# Altium schematic sheet mcu.SchDoc
size A3; SheetNumber: 1; SheetTotal: 3
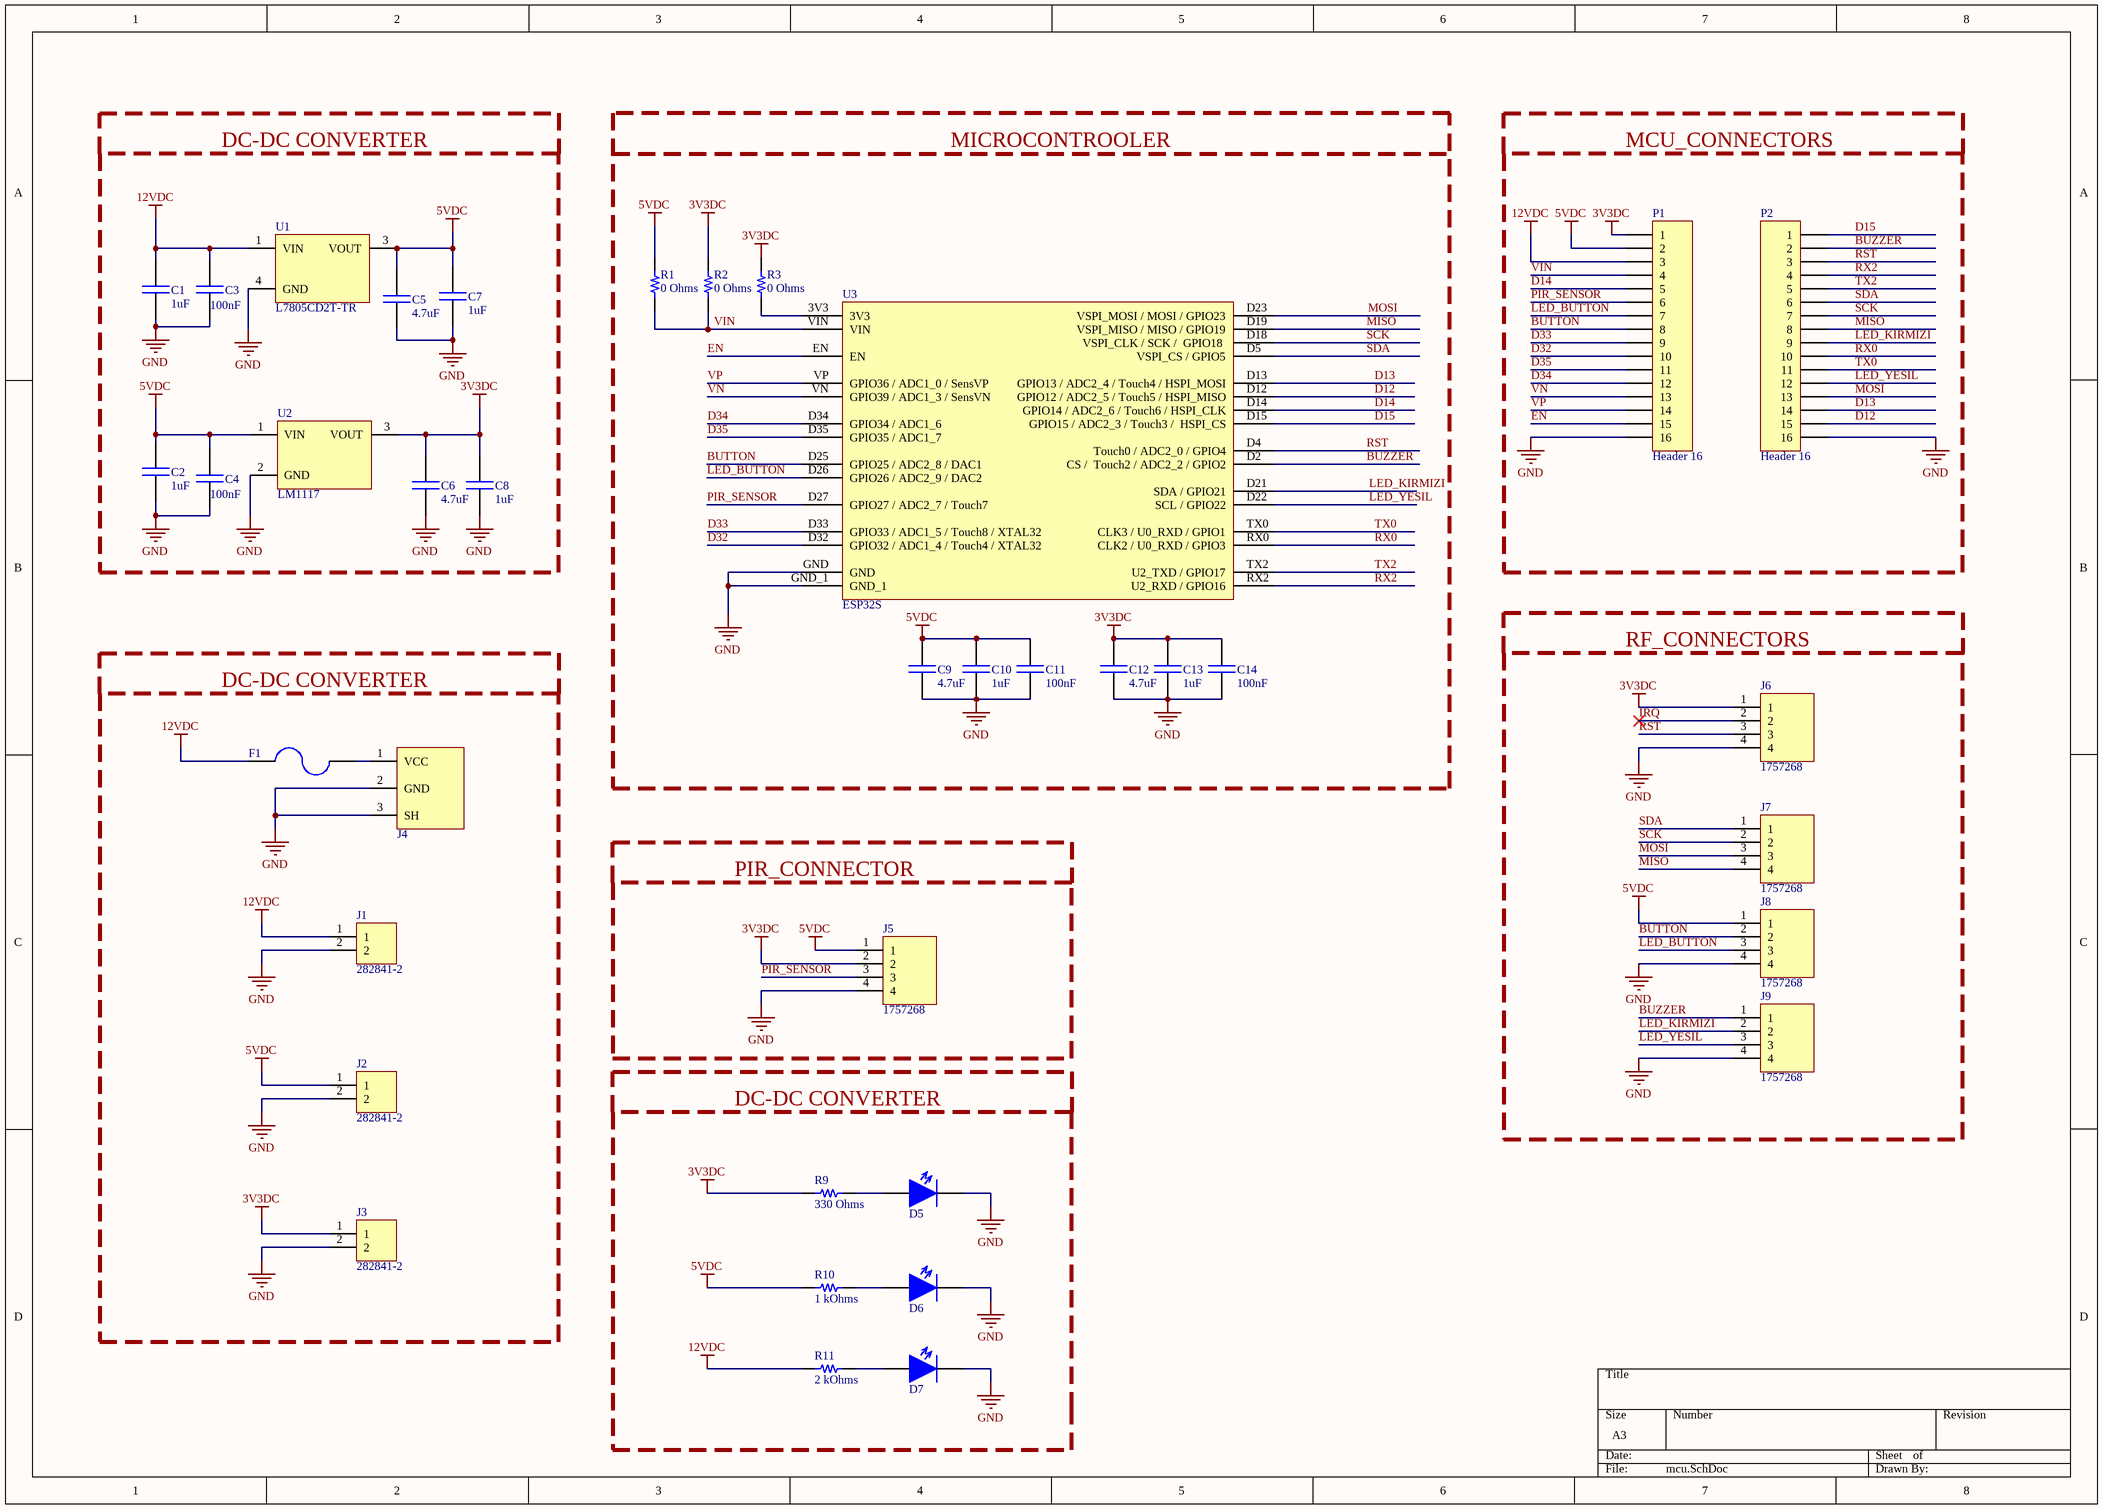
[diagram p0: mcu.SchDoc]

## Parts
C1  Capacitance: 1uF  [CAP_0805]  (hidden comment: CL21B105KBFNNNE)
C2  Capacitance: 1uF  [CAP_0805]  (hidden comment: CL21B105KBFNNNE)
C3  Capacitance: 100nF  [CAP_0805]  (hidden comment: CL21B104KBCNNNC)
C4  Capacitance: 100nF  [CAP_0805]  (hidden comment: CL21B104KBCNNNC)
C5  Capacitance: 4.7uF  [CAP_0805]  (hidden comment: CL21A475KAQNNNE)
C6  Capacitance: 4.7uF  [CAP_0805]  (hidden comment: CL21A475KAQNNNE)
C7  Capacitance: 1uF  [CAP_0805]  (hidden comment: CL21B105KBFNNNE)
C8  Capacitance: 1uF  [CAP_0805]  (hidden comment: CL21B105KBFNNNE)
C9  Capacitance: 4.7uF  [CAP_0805]  (hidden comment: CL21A475KAQNNNE)
C10  Capacitance: 1uF  [CAP_0805]  (hidden comment: CL21B105KBFNNNE)
C11  Capacitance: 100nF  [CAP_0805]  (hidden comment: CL21B104KBCNNNC)
C12  Capacitance: 4.7uF  [CAP_0805]  (hidden comment: CL21A475KAQNNNE)
C13  Capacitance: 1uF  [CAP_0805]  (hidden comment: CL21B105KBFNNNE)
C14  Capacitance: 100nF  [CAP_0805]  (hidden comment: CL21B104KBCNNNC)
D5  LTST-C171GKT  [LED_GREEN_0805]  (value not drawn)
D6  LH R974-LP-1-0-20-R18  [LED_RED_0805]  (value not drawn)
D7  LH R974-LP-1-0-20-R18  [LED_RED_0805]  (value not drawn)
F1  FUSE 3413.0216.22  [FUSE 3413.0216.22]  (value not drawn)
J1  282841-2  [connector_2pİN]
J2  282841-2  [connector_2pİN]
J3  282841-2  [connector_2pİN]
J4  PJ-037AH-SMT-TR  [JACK]  (value not drawn)
J5  1757268  [CONNECTOR_4Pin]
J6  1757268  [CONNECTOR_4Pin]
J7  1757268  [CONNECTOR_4Pin]
J8  1757268  [CONNECTOR_4Pin]
J9  1757268  [CONNECTOR_4Pin]
P1  Header 16  [HDR1X16]
P2  Header 16  [HDR1X16]
R1  0 Ohms  [RES 1206_3216]
R2  0 Ohms  [RES 1206_3216]
R3  0 Ohms  [RES 1206_3216]
R9  330 Ohms  [RES 0805_2012]
R10  1 kOhms  [RES 0805_2012]
R11  2 kOhms  [RES 0805_2012]
U1  L7805CD2T-TR  [D2PAK]
U2  LM1117  [SOT223]
U3  ESP32S  [ESP32_BOARD]

## Blocks framed on the sheet
MICROCONTROOLER: C9-C14 R1-R3 U3
DC-DC CONVERTER: C1-C8 U1 U2
MCU_CONNECTORS: P1 P2
RF_CONNECTORS: J6-J9
DC-DC CONVERTER: F1 J1-J4
PIR_CONNECTOR: J5
DC-DC CONVERTER: D5-D7 R9-R11

## Nets
3V3DC: C6.2 C8.2 C12.2 C13.2 C14.2 J3.1 J5.2 J6.1 P1.1 R2.2 R3.2 R9.1 U2.3(VOUT)
5VDC: C2.2 C4.2 C5.2 C7.2 C9.2 C10.2 C11.2 J2.1 J5.1 J8.1 P1.2 R1.2 R10.1 U1.3(VOUT) U2.1(VIN)
12VDC: C1.2 C3.2 F1.1 J1.1 P1.3 R11.1 U1.1(VIN)
GND: C1.1 C2.1 C3.1 C4.1 C5.1 C6.1 C7.1 C8.1 C9.1 C10.1 C11.1 C12.1 C13.1 C14.1 D5.1 D6.1 D7.1 J1.2 J2.2 J3.2 J4.2(GND) J4.3(SH) J5.4 J6.4 J8.4 J9.4 P1.16 P2.16 U1.4(GND) U2.2(GND) U3.GND U3.GND_1
BUTTON: J8.2 P1.8 U3.D25(GPIO25_/_ADC2_8_/_DAC1)
BUZZER: J9.1 P2.2 U3.D2(CS_/__Touch2_/_ADC2_2_/_GPIO2)
D12: P2.15 U3.D12(GPIO12_/_ADC2_5_/_Touch5_/_HSPI_MISO)
D13: P2.14 U3.D13(GPIO13_/_ADC2_4_/_Touch4_/_HSPI_MOSI)
D14: P1.5 U3.D14(GPIO14_/_ADC2_6_/_Touch6_/_HSPI_CLK)
D15: P2.1 U3.D15(GPIO15_/_ADC2_3_/_Touch3_/__HSPI_CS)
D32: P1.10 U3.D32(GPIO32_/_ADC1_4_/_Touch4_/_XTAL32)
D33: P1.9 U3.D33(GPIO33_/_ADC1_5_/_Touch8_/_XTAL32)
D34: P1.12 U3.D34(GPIO34_/_ADC1_6)
D35: P1.11 U3.D35(GPIO35_/_ADC1_7)
EN: P1.15 U3.EN
IRQ: J6.2
LED_BUTTON: J8.3 P1.7 U3.D26(GPIO26_/_ADC2_9_/_DAC2)
LED_KIRMIZI: J9.2 P2.9 U3.D21(SDA_/_GPIO21)
LED_YESIL: J9.3 P2.12 U3.D22(SCL_/_GPIO22)
MISO: J7.4 P2.8 U3.D19(VSPI_MISO_/_MISO_/_GPIO19)
MOSI: J7.3 P2.13 U3.D23(VSPI_MOSI_/_MOSI_/_GPIO23)
PIR_SENSOR: J5.3 P1.6 U3.D27(GPIO27_/_ADC2_7_/_Touch7)
RST: J6.3 P2.3 U3.D4(Touch0_/_ADC2_0_/_GPIO4)
RX0: P2.10 U3.RX0(CLK2_/_U0_RXD_/_GPIO3)
RX2: P2.4 U3.RX2(U2_RXD_/_GPIO16)
SCK: J7.2 P2.7 U3.D18(VSPI_CLK_/_SCK_/__GPIO18)
SDA: J7.1 P2.6 U3.D5(VSPI_CS_/_GPIO5)
TX0: P2.11 U3.TX0(CLK3_/_U0_RXD_/_GPIO1)
TX2: P2.5 U3.TX2(U2_TXD_/_GPIO17)
VIN: P1.4 R1.1 R2.1 U3.VIN
VN: P1.13 U3.VN(GPIO39_/_ADC1_3_/_SensVN)
VP: P1.14 U3.VP(GPIO36_/_ADC1_0_/_SensVP)
NetD5_2: D5.2 R9.2
NetD6_2: D6.2 R10.2
NetD7_2: D7.2 R11.2
NetF1_2: F1.2 J4.1(VCC)
NetR3_1: R3.1 U3.3V3

## Library data of the parts
C1 C2 C7 C8 C10 C13 = CAP CER 1uF 0805: CAP CER 1uF  %10 0805; Manufacturer: Samsung; Tolerance: 10%; Voltage Rating: 50V; Dielectric: X7R; Designed by: EMRE; Supplier 1: Digi-Key; Manufacturer Part Number: CL21B105KBFNNNE; RoHS: Yes; Category: Ceramic Capacitors; Stock 1: 279465; Pricing 1: 1=0,11000, 10=0,07900, 50=0,04500, 100=0,03730, 500=0,02616, 1000=0,02165 (USD); Mount: Surface Mount; Case/Package: 0805; Case Code (Metric): 2012; Case Code (Imperial): 0805; Min Operating Temperature: -55°C; Max Operating Temperature: 125°C; Packaging: Tape and Reel; Package Quantity: 1; Voltage: 50V; Series: CL; Construction: Flat; Length: 2mm; Width: 0.049inch; Height: 1.25mm; Thickness: 0.053inch; Depth: 1.25mm; Radiation Hardening: No; RoHS Compliant: Yes; ComponentLink1URL: https://datasheet.ciiva.com/25800/cl21b105kbfnnne-25800291.pdf?src-supplier=Digi-Key; ComponentLink1Description: https://datasheet.ciiva.com/25800/cl21b105kbfnnne-25800291.pdf?src-supplier=Digi-Key; ComponentLink2URL: https://datasheet.ciiva.com/16449/cl21b105kbfnnne-16449003.pdf?src-supplier=Future+Electronics; ComponentLink2Description: https://datasheet.ciiva.com/16449/cl21b105kbfnnne-16449003.pdf?src-supplier=Future+Electronics; ComponentLink3URL: https://datasheet.ciiva.com/26838/getdatasheetpartid-354075-26838668.pdf?src-supplier=Verical; ComponentLink3Description: https://datasheet.ciiva.com/26838/getdatasheetpartid-354075-26838668.pdf?src-supplier=Verical; Supplier Part Number 1: 1276-1029-1-ND
C3 C4 C11 C14 = CAP CER 100nF 0805: CAP CER 100nF  %10 0805; Manufacturer: Samsung; Designed by: EMRE; Material: Ceramic; Tolerance: 10%; Dielectric: X7R; Voltage Rating: 50V; Supplier 1: Digi-Key; Manufacturer Part Number: CL21B104KBCNNNC; RoHS: Yes; Category: Ceramic Capacitors; Stock 1: 4556397; Pricing 1: 1=0,10000, 10=0,04400, 50=0,02400, 100=0,01960, 500=0,01404, 1000=0,01103 (USD); Mount: Surface Mount; Case/Package: 0805; Case Code (Metric): 2012; Case Code (Imperial): 0805; Contact Plating: Tin; Min Operating Temperature: -55°C; Max Operating Temperature: 125°C; Packaging: Tape and Reel; Voltage: 50V; Voltage Rating (DC): 50V; Series: CL; Construction: Flat; Length: 2mm; Width: 0.049inch; Height: 0.85mm; Depth: 1.25mm; Thickness: 0.037inch; Radiation Hardening: No; Lead Free: Lead Free; RoHS Compliant: Yes; ComponentLink1URL: https://datasheet.ciiva.com/25710/cl21b104kbcnnnc-25710182.pdf?src-supplier=Digi-Key; ComponentLink1Description: https://datasheet.ciiva.com/25710/cl21b104kbcnnnc-25710182.pdf?src-supplier=Digi-Key; ComponentLink2URL: https://datasheet.ciiva.com/29199/454152-da-01-en-vs-kondensator-0805-29199814.pdf?src-supplier=Conrad; ComponentLink2Description: https://datasheet.ciiva.com/29199/454152-da-01-en-vs-kondensator-0805-29199814.pdf?src-supplier=Conrad; Supplier Part Number 1: 1276-1003-1-ND
C5 C6 C9 C12 = CAP CER 4.7uF 0805: CAP CER 4.7UF  %10 0805; Manufacturer: Samsung; Designed by: EMRE; Tolerance: 10%; Voltage Rating: 25V; Dielectric: X5R; Supplier 1: Digi-Key; Manufacturer Part Number: CL21A475KAQNNNE; RoHS: Yes; Category: Ceramic Capacitors; Stock 1: 4929728; Pricing 1: 1=0,10000, 10=0,07300, 50=0,04140, 100=0,03440, 500=0,02408, 1000=0,01994 (USD); Mount: Surface Mount; Case/Package: 0805; Case Code (Metric): 2012; Case Code (Imperial): 0805; Min Operating Temperature: -55°C; Max Operating Temperature: 85°C; Package Quantity: 1; Packaging: Tape and Reel; Voltage Rating (DC): 25V; Series: CL; Construction: Flat; Length: 2mm; Width: 0.049inch; Height: 1.25mm; Thickness: 0.055inch; Depth: 1.25mm; Radiation Hardening: No; Lead Free: Lead Free; RoHS Compliant: Yes; ComponentLink1URL: https://datasheet.ciiva.com/25798/cl21a475kaqnnne-25798882.pdf?src-supplier=Digi-Key; ComponentLink1Description: https://datasheet.ciiva.com/25798/cl21a475kaqnnne-25798882.pdf?src-supplier=Digi-Key; Supplier Part Number 1: 1276-1244-1-ND
D5 = LED GREEN 0805: Green 569nm LED Indication - Discrete 2.1V 0805 (2012 Metric); Manufacturer: Vishay Lite-On; Designed by: EMRE; Lens Color: Colorless; Viewing Angle: 130°; Lens Style: Diffused,Colorless,Rectangular,Clear; Luminous Intensity: 12mcd; Forward Current: 30mA; Power Rating: 100mW; Test Current: 10mA; Lens Transparency: Clear; Number of Elements: 1; Wavelength: 585nm; Reverse Voltage: 5V; Supplier 1: Digi-Key; Manufacturer Part Number: LTST-C171GKT; RoHS: Yes; Category: LEDs; Stock 1: 498344; Pricing 1: 1=0,26000, 10=0,14100, 100=0,06560, 500=0,06060, 1000=0,04747 (USD); Mount: Surface Mount; Case/Package: 0805; Number of Pins: 2; Color: Green; Case Code (Metric): 2012; Case Code (Imperial): 0805; Min Operating Temperature: -55°C; Max Operating Temperature: 85°C; Package Quantity: 1; Packaging: Tape and Reel; Forward Voltage: 2.1V; Illumination Color: Green; Dominant Wavelength: 569nm; Power Dissipation: 100mW; Number of LEDs: 1; Series: CHIPLED 0805; Length: 2mm; Width: 1.25mm; Height: 0.8mm; Depth: 1.25mm; Radiation Hardening: No; Lead Free: Lead Free; RoHS Compliant: Yes; ComponentLink1URL: https://datasheet.ciiva.com/2110/ltst-c171gkt-2110000.pdf?src-supplier=Digi-Key; ComponentLink1Description: https://datasheet.ciiva.com/2110/ltst-c171gkt-2110000.pdf?src-supplier=Digi-Key; ComponentLink2URL: https://datasheet.ciiva.com/11773/0900766b80dc0296-11773991.pdf?src-supplier=RSComponents; ComponentLink2Description: https://datasheet.ciiva.com/11773/0900766b80dc0296-11773991.pdf?src-supplier=RSComponents; ComponentLink3URL: https://datasheet.ciiva.com/12400/lite-on-ltst-c171gkt-190133-12400647.pdf?src-supplier=Mouser; ComponentLink3Description: https://datasheet.ciiva.com/12400/lite-on-ltst-c171gkt-190133-12400647.pdf?src-supplier=Mouser; ComponentLink4URL: https://datasheet.ciiva.com/2110/ltst-c171gkt-2110001.pdf?src-supplier=Digi-Key; ComponentLink4Description: https://datasheet.ciiva.com/2110/ltst-c171gkt-2110001.pdf?src-supplier=Digi-Key; ComponentLink5URL: https://datasheet.ciiva.com/2110/ltst-c171gkt-2110002.pdf?src-supplier=Digi-Key; ComponentLink5Description: https://datasheet.ciiva.com/2110/ltst-c171gkt-2110002.pdf?src-supplier=Digi-Key; ComponentLink6URL: https://datasheet.ciiva.com/16396/ltst-c171gkt-16396549.pdf?src-supplier=Future+Electronics; ComponentLink6Description: https://datasheet.ciiva.com/16396/ltst-c171gkt-16396549.pdf?src-supplier=Future+Electronics; Supplier Part Number 1: 160-1423-1-ND
D6 D7 = LED RED 0805: Chipled 0805 Hyp Red 645NM; Manufacturer: Osram Opto; Lens Style: Diffused; Viewing Angle: 160°; Wavelength: 660nm; Luminous Intensity: 15mcd; Forward Voltage: 1.8V; Designed by: EMRE; Supplier 1: Digi-Key; Manufacturer Part Number: LHR974-LP-1-0-20-R18; RoHS: Yes; Category: LEDs; Case/Package: 0805; Lead Free: Lead Free; RoHS Compliant: Yes; ComponentLink1URL: https://www.verical.com/server-webapp/html/getDatasheet?partID=752067&src-supplier=Verical; ComponentLink1Description: https://www.verical.com/server-webapp/html/getDatasheet?partID=752067&src-supplier=Verical; Supplier Part Number 1: 475-LHR974-LP-1-0-20-R18TR-ND
F1 = FUSE 3413.0216.22: Fuse Chip Fast Acting 1A 32V SMD Solder Pad 1206 Glass T/R VDE/cULus; Manufacturer: Schurter; Designed by: EMRE; Body Material: Glass,Epoxy; Max Voltage Rating (DC): 63V; DC Cold Resistance: 94.2mR; Fuse Type: Board Mount (Cartridge Style Excluded); Approvals: VDE,cURus; Supplier 1: Digi-Key; Manufacturer Part Number: 3413.0216.22; RoHS: Yes; Category: Fuses; Stock 1: 13574; Pricing 1: 1=0,67000, 50=0,52400, 100=0,39700, 500=0,32624 (USD); Mount: Surface Mount,PCB; Case/Package: 1206; Number of Pins: 2; Weight: 0.000212oz; Case Code (Metric): 3216; Case Code (Imperial): 1206; Contact Plating: Gold; Housing Material: Glass; Terminal Material: Tin; Min Operating Temperature: -55°C; Max Operating Temperature: 90°C; Current Rating: 1A; Package Quantity: 1000; Voltage Rating (AC): 32V; Voltage Rating (DC): 63V; Packaging: Tape and Reel; Max Voltage Rating (AC): 32V; Voltage Rating: 32V; Termination: SMD/SMT; Working Voltage: 32V; Series: USI 1206; Length: 3.2mm; Width: 1.6mm; Height: 0.6mm; Depth: 1.6mm; Radiation Hardening: No; Lead Free: Lead Free; RoHS Compliant: Yes; ComponentLink1URL: https://datasheet.ciiva.com/301/typ-usi-1206-301440.pdf?src-supplier=Digi-Key; ComponentLink1Description: https://datasheet.ciiva.com/301/typ-usi-1206-301440.pdf?src-supplier=Digi-Key; ComponentLink2URL: https://datasheet.ciiva.com/14541/70160006-14541114.pdf?src-supplier=Allied+Electronics; ComponentLink2Description: https://datasheet.ciiva.com/14541/70160006-14541114.pdf?src-supplier=Allied+Electronics; ComponentLink3URL: https://datasheet.ciiva.com/301/typ-usi-1206-301439.pdf?src-supplier=Digi-Key; ComponentLink3Description: https://datasheet.ciiva.com/301/typ-usi-1206-301439.pdf?src-supplier=Digi-Key; ComponentLink4URL: https://datasheet.ciiva.com/301/typ-usi-1206-301441.pdf?src-supplier=Digi-Key; ComponentLink4Description: https://datasheet.ciiva.com/301/typ-usi-1206-301441.pdf?src-supplier=Digi-Key; ComponentLink5URL: https://datasheet.ciiva.com/8264/typ-usi-1206-8264583.pdf?src-supplier=Avnet; ComponentLink5Description: https://datasheet.ciiva.com/8264/typ-usi-1206-8264583.pdf?src-supplier=Avnet; ComponentLink6URL: https://datasheet.ciiva.com/14102/qousi1206-data-e-14102903.pdf?src-supplier=Distrelec; ComponentLink6Description: https://datasheet.ciiva.com/14102/qousi1206-data-e-14102903.pdf?src-supplier=Distrelec; ComponentLink7URL: https://datasheet.ciiva.com/16316/typ-usi-1206-16316588.pdf?src-supplier=Future+Electronics; ComponentLink7Description: https://datasheet.ciiva.com/16316/typ-usi-1206-16316588.pdf?src-supplier=Future+Electronics; Supplier Part Number 1: 486-1144-1-ND
J1-J3 = CONNECTOR_2Pin: Conn Terminal Block 2 POS 5.08mm Solder ST Thru-Hole 17.5A/Contact; Manufacturer: TE Connectivity; Plating: Brass; Number of Levels: 1; Number of Positions Per Level: 2; Current: 17.5A; Voltage: 300V; Connector Type: Receptacle; Closed End: No (Without); Interlock: Yes (With); Gender: Male; Wire Gauge (Max): 30AWG; Thread Size: M3; Tail Length: 3.5mm; Supplier 1: Digi-Key; Manufacturer Part Number: 282841-2; RoHS: Yes; Category: Terminal Blocks; Stock 1: 18756; Pricing 1: 1=0,88, 10=0,836, 25=0,7992, 50=0,788, 100=0,6886, 250=0,66288, 500=0,62604, 1000=0,54134, 5000=0,464 (USD); Mount: Through Hole; Contact Plating: Tin; Color: Green; Housing Color: Green; Housing Material: Polyamide; Contact Material: Brass; Material: Nylon; Min Operating Temperature: -40°C; Max Operating Temperature: 105°C; Packaging: Carton; Termination: Solder; Series: Buchanan; Package Quantity: 300; Number of Rows: 1; Number of Contacts: 2; Number of Circuits: 2; Orientation: Straight; Current Rating: 17.5A; Number of Positions: 2; Voltage Rating: 300V; Max Current Rating: 17.5A; Screw Flange: No (Without); Screwless Terminal Block: Yes (With); Side Stackable: No (Without); Max Supply Voltage (AC): 300V; Number of Poles: 2; Max Voltage Rating (AC): 300V; Length: 10.16mm; Width: 9mm; Wire Gauge (Min): 30AWG; Pitch: 5.08mm; Depth: 9mm; Wire/Cable Gauge: 30AWG; Radiation Hardening: No; RoHS Compliant: Yes; ELV: Compliant; Flammability Rating: UL94 V-0; Lead Free: Lead Free; Reach SVHC Compliant: Unknown; ComponentLink1URL: https://datasheet.ciiva.com/11758/0900766b80e7dc90-11758676.pdf?src-supplier=Rs; ComponentLink1Description: https://datasheet.ciiva.com/11758/0900766b80e7dc90-11758676.pdf?src-supplier=Rs; ComponentLink2URL: https://datasheet.ciiva.com/15225/getdatasheetpartid-155859-15225932.pdf?src-supplier=Verical; ComponentLink2Description: https://datasheet.ciiva.com/15225/getdatasheetpartid-155859-15225932.pdf?src-supplier=Verical; ComponentLink3URL: https://datasheet.ciiva.com/823/eng-cd-282841-h6-823441.pdf?src-supplier=Digi-Key; ComponentLink3Description: https://datasheet.ciiva.com/823/eng-cd-282841-h6-823441.pdf?src-supplier=Digi-Key; ComponentLink4URL: https://datasheet.ciiva.com/30126/eng-cs-1308389-eurostyle-terminal-blocks-0607-30126654.pdf?src-supplier=Onlinecomponents.com; ComponentLink4Description: https://datasheet.ciiva.com/30126/eng-cs-1308389-eurostyle-terminal-blocks-0607-30126654.pdf?src-supplier=Onlinecomponents.com; Supplier Part Number 1: A98342-ND
J4 = PJ-037AH-SMT-TR: 2.0 x 6.3 mm, 5.0 A, Horizontal, Surface Mount (SMT), Dc Power Jack Connector; Manufacturer: CUI; Designed by: EMRE; Number of Conductors: 2; Gender: Male; Shielding: Unshielded; Current Rating: 5A; Voltage Rating: 24V; Insulation Resistance: 100MR; Supplier 1: Digi-Key; Manufacturer Part Number: PJ-037AH-SMT-TR; RoHS: Yes; Category: Connectors; Stock 1: 7547; Pricing 1: 1=1,510000, 10=1,317000, 25=1,261200, 50=1,233200, 100=1,177200 (USD); Mount: Surface Mount,Through Hole; Case/Package: SMD/SMT; Color: Black; Contact Material: Copper; Contact Plating: Nickel; Housing Color: Black; Housing Material: Thermoplastic; Min Operating Temperature: -25°C; Max Operating Temperature: 85°C; Orientation: Horizontal; Package Quantity: 200; Termination: Solder; Connector Type: Jack; Contact Gender: Male; Packaging: Tape and Reel; Flammability Rating: UL94 V-0; ComponentLink1URL: http://www.mouser.com/ds/2/670/pj-037ah-smt-516065.pdf?src-supplier=Mouser; ComponentLink1Description: http://www.mouser.com/ds/2/670/pj-037ah-smt-516065.pdf?src-supplier=Mouser; ComponentLink2URL: https://www.cui.com/product/resource/digikeypdf/pj-037ah-smt-tr.pdf?src-supplier=Digi-Key; ComponentLink2Description: https://www.cui.com/product/resource/digikeypdf/pj-037ah-smt-tr.pdf?src-supplier=Digi-Key; ComponentLink3URL: http://www.cui.com/product/resource/digikeypdf/pj-037ah-smt.pdf?src-supplier=Digi-Key; ComponentLink3Description: http://www.cui.com/product/resource/digikeypdf/pj-037ah-smt.pdf?src-supplier=Digi-Key; Supplier Part Number 1: CP-037AHPJCT-ND
J5-J9 = CONNECTOR_4Pin: Terminal Header; 12 A; 5.08 mm; 4; Solder Mount; 1.4 mm; 4 kV; 250 V; PBT; Manufacturer: Phoenix Contact; Max Current Rating: 12A; Voltage Rating: 250V; Number of Positions Per Level: 4; Number of Levels: 1; Current: 15A; Voltage: 300V; Gender: Male; Connector Type: Plug; Pitch: 5.08mm; Approvals: UL,CSA; Supplier 1: Digi-Key; Manufacturer Part Number: 1757268; RoHS: Yes; Category: Terminal Blocks; Stock 1: 17192; Pricing 1: 1=1,62, 10=1,484, 50=1,419, 100=1,3803, 250=1,29, 500=1,1868, 1000=1,0965, 2500=1,0449, 5000=0,9804 (USD); Mount: Through Hole; Color: Green; Contact Plating: Tin; Weight: 5.396916oz; Housing Color: Green; Housing Material: Polybutylene; Contact Material: Tin; Package Quantity: 50; Packaging: Bulk; Series: MSTBA; Termination: Solder; Number of Rows: 1; Current Rating: 12A; Number of Positions: 4; Number of Contacts: 4; Orientation: Right Angle; Voltage Rating (DC): 250V; Number of Poles: 4; Length: 22.32mm; Width: 22.24mm; Height: 12.1mm; Depth: 12mm; RoHS Compliant: Yes; Reach SVHC Compliant: No; Lead Free: Lead Free; Flammability Rating: UL94 V-0; ComponentLink1URL: https://datasheet.ciiva.com/16096/1757268-16096406.pdf?src-supplier=Onlinecomponents.com; ComponentLink1Description: https://datasheet.ciiva.com/16096/1757268-16096406.pdf?src-supplier=Onlinecomponents.com; ComponentLink2URL: https://datasheet.ciiva.com/15197/getdatasheetpartid-176352-15197330.pdf?src-supplier=Verical; ComponentLink2Description: https://datasheet.ciiva.com/15197/getdatasheetpartid-176352-15197330.pdf?src-supplier=Verical; ComponentLink3URL: https://datasheet.ciiva.com/795/1757268-795434.pdf?src-supplier=Digi-Key; ComponentLink3Description: https://datasheet.ciiva.com/795/1757268-795434.pdf?src-supplier=Digi-Key; ComponentLink4URL: https://datasheet.ciiva.com/7630/1697153-7630841.pdf?src-supplier=Element14; ComponentLink4Description: https://datasheet.ciiva.com/7630/1697153-7630841.pdf?src-supplier=Element14; ComponentLink5URL: https://datasheet.ciiva.com/29210/569323-da-01-en-grundgehaeuse-1757268-250-st-29210575.pdf?src-supplier=Conrad; ComponentLink5Description: https://datasheet.ciiva.com/29210/569323-da-01-en-grundgehaeuse-1757268-250-st-29210575.pdf?src-supplier=Conrad; ComponentLink6URL: https://datasheet.ciiva.com/16703/70054631-16703596.pdf?src-supplier=Allied+Electronics; ComponentLink6Description: https://datasheet.ciiva.com/16703/70054631-16703596.pdf?src-supplier=Allied+Electronics; Supplier Part Number 1: 277-1108-ND
P1 P2 = Header 16: Header, 16-Pin; LatestRevisionDate: 17-Jul-2002; LatestRevisionNote: Re-released for DXP Platform.; Publisher: Altium Limited
R1-R3 = RC1206FR-130RL: RES 0 OHM JUMPER 1206; Manufacturer: Yageo; Part Number: RC1206FR-130RL; ComponentLink1Description: Datasheet; ComponentLink1URL: https://www.yageo.com/upload/media/product/productsearch/datasheet/rchip/PYu-RC_Group_51_RoHS_L_12.pdf; ComponentLink2Description: DigiKey Link; ComponentLink2URL: https://www.digikey.com/en/products/detail/yageo/RC1206FR-130RL/16982181; Composition: Thick Film; Device Package: 1206 (3216 Metric); Features: Moisture Resistant; Height - Seated (Max): 0.026" (0.65mm); LastUpdated: 1.05.2023 19:33:04; Lifecycle Status: Active; Minimum Order: 1; Number of Terminations: 2; Operating Temperature: -55°C ~ 155°C; Package / Case: 1206 (3216 Metric); Packaging: TapeAndReel; PartId: 76721; Part Status: Active; Price: 0.01; Resistance: 0 Ohms; Series: RC_L; Size / Dimension: 0.122" L x 0.063" W (3.10mm x 1.60mm); Supplier 1: DigiKey; Supplier Part Number 1: 13-RC1206FR-130RLCT-ND; Supplier Device Package: 1206; Tolerance: Jumper; Value: 0 Ohms
R9 = ESR10EZPJ331: RES SMD 330 OHM 5% 0.4W 0805; Manufacturer: Rohm Semiconductor; Power (Watts): 0.4W, 2/5W; Temperature Coefficient: ±200ppm/°C; Part Number: ESR10EZPJ331; Value: 330 Ohms; ComponentLink1Description: Datasheet; ComponentLink1URL: https://www.rohm.com/datasheet/ESR01MZPF/esr-e; ComponentLink2Description: DigiKey Link; ComponentLink2URL: https://www.digikey.com/en/products/detail/rohm-semiconductor/ESR10EZPJ331/1762807; Composition: Thick Film; Device Package: 0805 (2012 Metric); Features: Automotive AEC-Q200, Pulse Withstanding; Height - Seated (Max): 0.026" (0.65mm); LastUpdated: 1.05.2023 19:42:01; Lifecycle Status: Active; Minimum Order: 1; Number of Terminations: 2; Operating Temperature: -55°C ~ 155°C; Package / Case: 0805 (2012 Metric); Packaging: TapeAndReel; PartId: 32307; Part Status: Active; Price: 0.01; Ratings: AEC-Q200; Resistance: 330 Ohms; Series: ESR; Size / Dimension: 0.079" L x 0.049" W (2.00mm x 1.25mm); Supplier 1: DigiKey; Supplier Part Number 1: RHM330KCT-ND; Supplier Device Package: 0805; Tolerance: ±5%
R10 = ERA-6AEB102V: RES 1K OHM 0.1% 1/8W 0805; Manufacturer: Panasonic Electronic Components; Power (Watts): 0.125W, 1/8W; Temperature Coefficient: ±25ppm/°C; Part Number: ERA-6AEB102V; Value: 1 kOhms; ComponentLink1Description: Datasheet; ComponentLink1URL: https://industrial.panasonic.com/cdbs/www-data/pdf/RDM0000/AOA0000C307.pdf; ComponentLink2Description: DigiKey Link; ComponentLink2URL: https://www.digikey.com/en/products/detail/panasonic-electronic-components/ERA-6AEB102V/1465748; Composition: Thin Film; Device Package: 0805 (2012 Metric); Features: Automotive AEC-Q200; Height - Seated (Max): 0.024" (0.60mm); LastUpdated: 23.05.2023 19:59:49; Lifecycle Status: Active; Minimum Order: 1; Number of Terminations: 2; Operating Temperature: -55°C ~ 155°C; Package / Case: 0805 (2012 Metric); Packaging: TapeAndReel; PartId: 28065; Part Status: Active; Price: 0.03; Ratings: AEC-Q200; Resistance: 1 kOhms; Series: ERA-6A; Size / Dimension: 0.079" L x 0.049" W (2.00mm x 1.25mm); Supplier 1: DigiKey; Supplier Part Number 1: P1.0KDACT-ND; Supplier Device Package: 0805; Tolerance: ±0.1%
R11 = RC0805FR-072KP: RES SMD 2K OHM 1% 1/8W 0805; Manufacturer: Yageo; Power (Watts): 0.125W, 1/8W; Temperature Coefficient: ±100ppm/°C; Part Number: RC0805FR-072KP; Value: 2 kOhms; ComponentLink1Description: Datasheet; ComponentLink1URL: http://www.yageo.com/NewPortal/yageodocoutput?fileName=/pdf/R-Chip/PYu-RC_51_RoHS_P_0.pdf; ComponentLink2Description: DigiKey Link; ComponentLink2URL: https://www.digikey.com/en/products/detail/yageo/RC0805FR-072KP/4935337; Composition: Thick Film; Device Package: 0805 (2012 Metric); Features: Moisture Resistant; Height - Seated (Max): 0.024" (0.60mm); LastUpdated: 23.05.2023 19:59:47; Lifecycle Status: Active; Minimum Order: 1; Number of Terminations: 2; Operating Temperature: -55°C ~ 155°C; Package / Case: 0805 (2012 Metric); Packaging: TapeAndReel; PartId: 28672; Part Status: Active; Price: 0.01; Resistance: 2 kOhms; Series: RC-P Lead Free; Size / Dimension: 0.079" L x 0.049" W (2.00mm x 1.25mm); Supplier 1: DigiKey; Supplier Part Number 1: YAG1322CT-ND; Supplier Device Package: 0805; Tolerance: ±1%
U1 = 7805
U3 = ESP32_BOARD